# Altium schematic sheet CRAFT_Negativesupply.SchDoc
size A
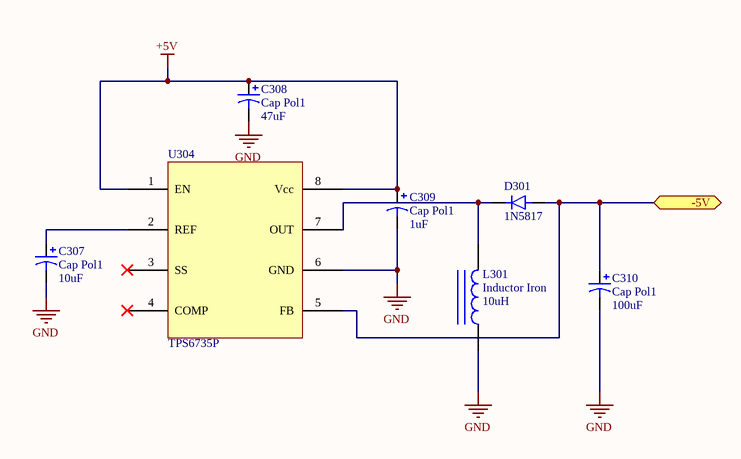
[diagram p0: CRAFT_Negativesupply.SchDoc]

## Parts
C307  Cap Pol1  value 10uF  [CAPPRD250W50D630H1120]
C308  Cap Pol1  value 47uF  [CAPPRD250W50D630H1120]
C309  Cap Pol1  value 1uF  [CAPPRD250W50D630H1120]
C310  Cap Pol1  value 100uF  [CAPPRD250W50D630H1120]
D301  1N5817  [DIOAD1036W78L470D235]
L301  Inductor Iron  value 10uH  [INDRD500W70D900H1220]
U304  TPS6735P  [DIP794W45P254L959H508Q8]

## Ports
-5V

## Nets
+5V: C308.1 C309.1 U304.1(EN) U304.8(Vcc)
GND: C307.2 C308.2 C309.2 C310.2 L301.1 U304.6(GND)
-5V: C310.1 D301.A U304.5(FB) ; port -5V
NetC307_1: C307.1 U304.2(REF)
NetD301_C: D301.C(K) L301.2 U304.7(OUT)

Not connected (* = marked no-connect by the designer): U304 3(SS)* 4(COMP)*

## Library data of the parts
C307-C310 = Cap Pol1: Polarized Capacitor (Radial); pin to pad: 1>P 2>N; Published: 8-Jun-2000; LatestRevisionDate: 17-Jul-2002; LatestRevisionNote: Re-released for DXP Platform.; PackageReference: RB7.6-15; Publisher: Altium Limited; PackageDescription: Polarized Capacitor (Radial); 2 Leads
D301 = 1N5817: Diode Schottky 20 V 1A Through Hole DO-41; MF: STMicroelectronics; Package: DO-41 Panjit; Check_prices: https://www.snapeda.com/parts/1N5817/STMicroelectronics/view-part/?ref=eda; Value: *; Price: None; Purchase-URL: https://pricing.snapeda.com/search/part/1N5817/?ref=eda; MP: 1N5817; SnapEDA_Link: https://www.snapeda.com/parts/1N5817/STMicroelectronics/view-part/?ref=snap; Availability: In Stock
L301 = Inductor Iron: Magnetic-Core Inductor; Published: 24-Mar-1999; LatestRevisionDate: 17-Jul-2002; LatestRevisionNote: Re-released for DXP Platform.; PackageReference: AXIAL-0.9; Publisher: Altium Limited; PackageDescription: Axial Device, Thru-Hole; 2 Leads; 0.9 in Pin Spacing